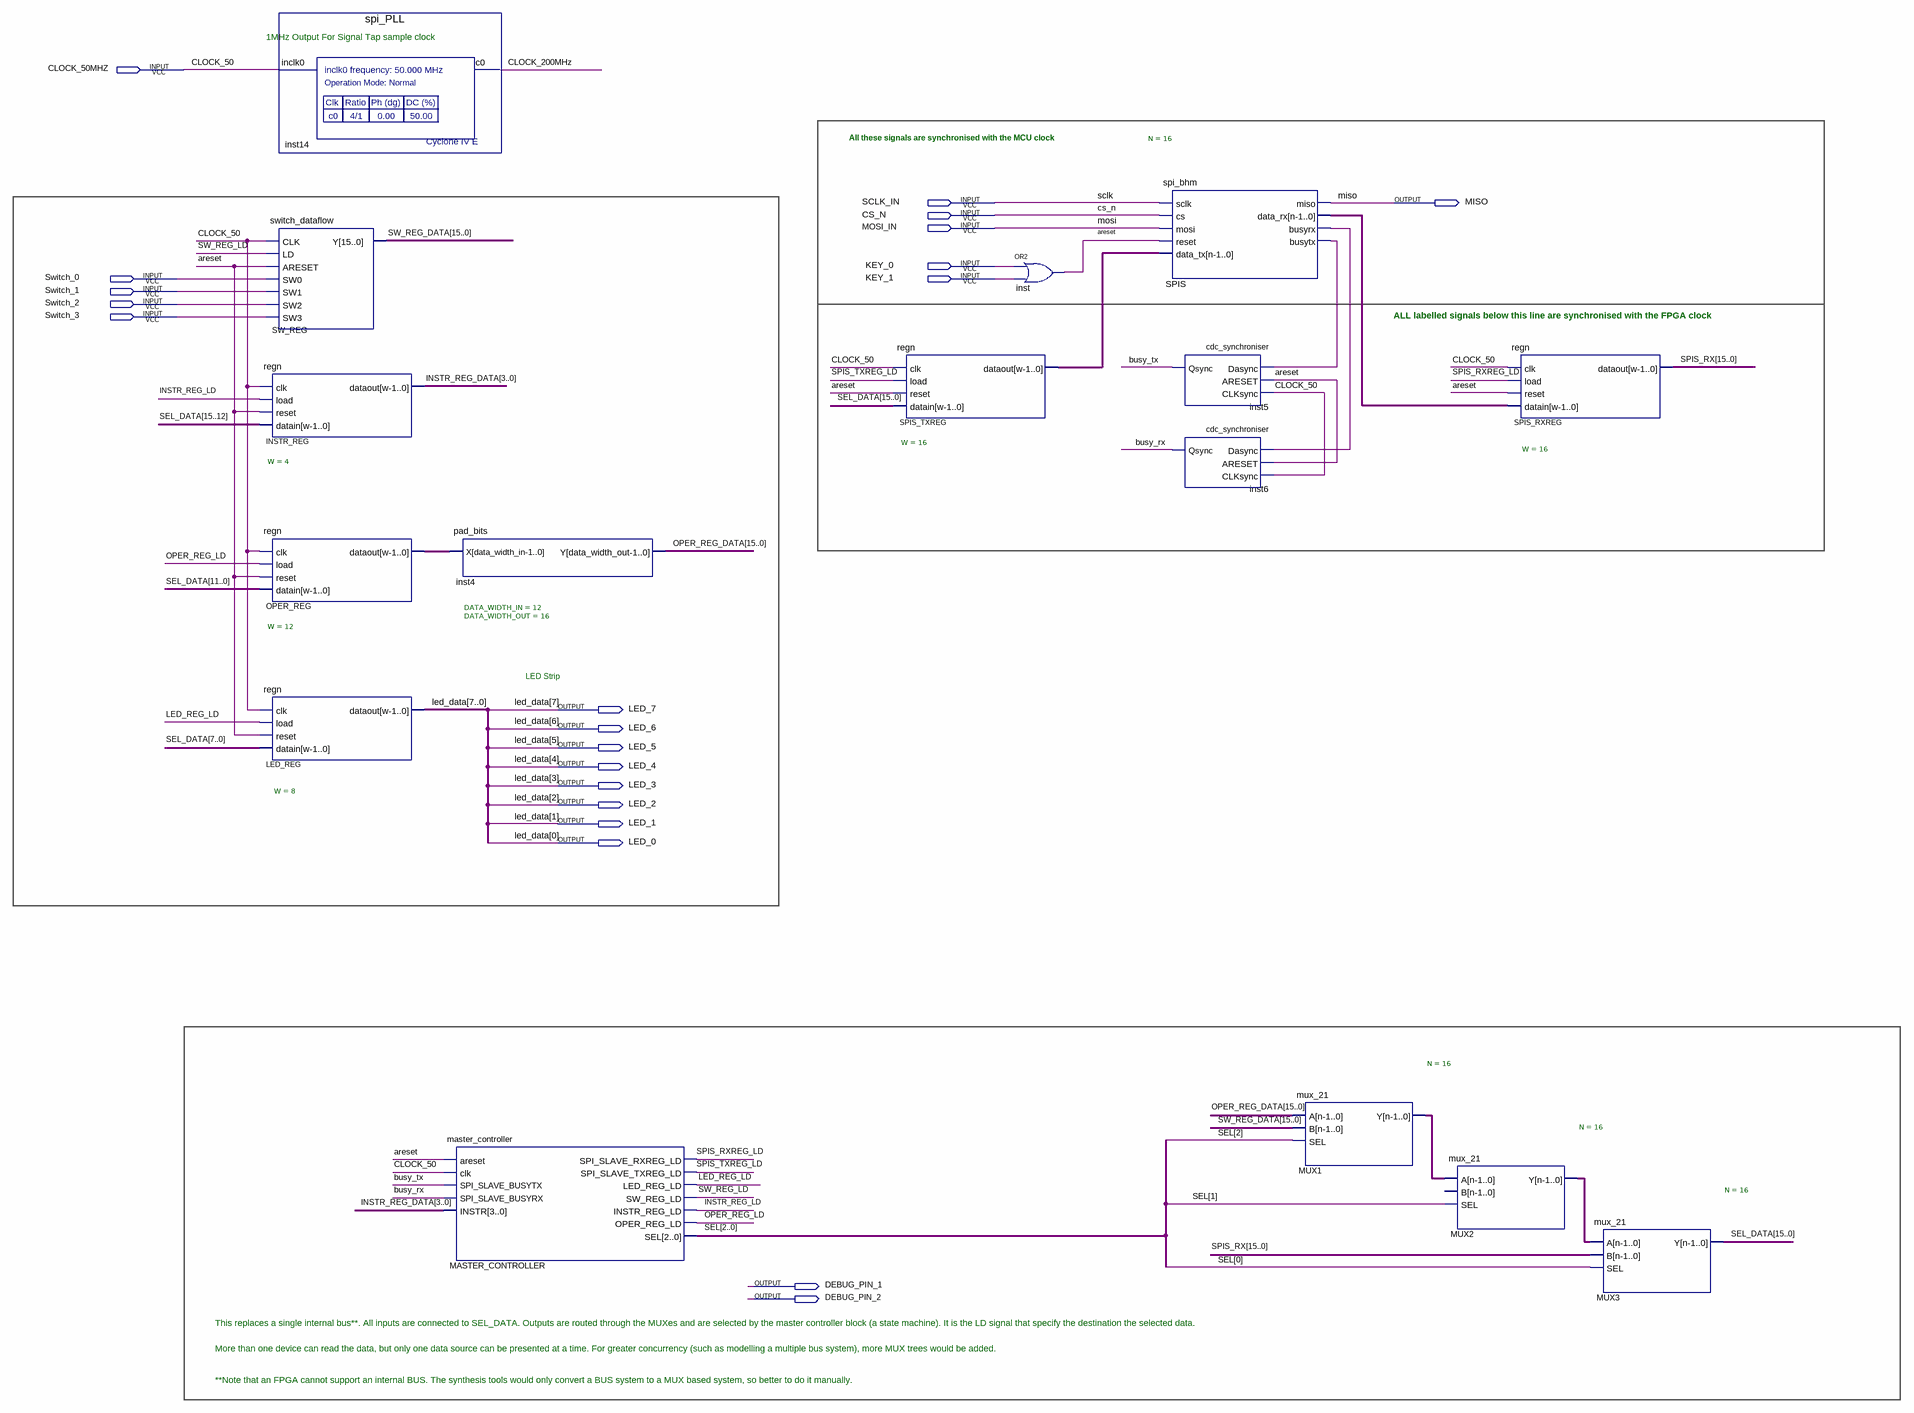
[diagram p0: schematic sheet]
// Quartus schematic spi_test.bdf as structural Verilog: 16 symbols, 21 pins
module spi_test (
  input  CLOCK_50MHZ,
  input  SCLK_IN,
  input  CS_N,
  input  MOSI_IN,
  input  KEY_0,
  input  Switch_0,
  input  KEY_1,
  input  Switch_1,
  input  Switch_2,
  input  Switch_3,
  output MISO,
  output LED_7,
  output LED_6,
  output LED_5,
  output LED_4,
  output LED_3,
  output LED_2,
  output LED_1,
  output LED_0,
  output DEBUG_PIN_1,
  output DEBUG_PIN_2
);

  wire areset, busy_rx, busy_tx, CLOCK_200MHz, INSTR_REG_LD, LED_REG_LD, OPER_REG_LD, SPIS_busyrx,
       SPIS_busytx, SPIS_RXREG_LD, SPIS_TXREG_LD, SW_REG_LD;
  wire [2:0] SEL;
  wire [3:0] INSTR_REG_DATA;
  wire [11:0] OPER_REG_dataout;
  wire [15:0] MUX1_y, MUX2_y, OPER_REG_DATA, SEL_DATA, SPIS_data_rx, SPIS_RX, SPIS_TXREG_dataout, SW_REG_DATA;

  switch_dataflow SW_REG (
    .CLK(CLOCK_50MHZ), .LD(SW_REG_LD), .ARESET(areset), .SW0(Switch_0), .SW1(Switch_1), .SW2(Switch_2),
    .SW3(Switch_3), .Y(SW_REG_DATA));
  regn #(.W(4)) INSTR_REG (
    .clk(CLOCK_50MHZ), .load(INSTR_REG_LD), .reset(areset), .datain(SEL_DATA[15:12]), .dataout(INSTR_REG_DATA));
  regn #(.W(12)) OPER_REG (
    .clk(CLOCK_50MHZ), .load(OPER_REG_LD), .reset(areset), .datain(SEL_DATA[11:0]), .dataout(OPER_REG_dataout));
  regn #(.W(8)) LED_REG (
    .clk(CLOCK_50MHZ), .load(LED_REG_LD), .reset(areset), .datain(SEL_DATA[7:0]),
    .dataout({LED_7, LED_6, LED_5, LED_4, LED_3, LED_2, LED_1, LED_0}));
  spi_PLL inst14 (.inclk0(CLOCK_50MHZ), .c0(CLOCK_200MHz));
  pad_bits #(.DATA_WIDTH_IN(12), .DATA_WIDTH_OUT(16)) inst4 (.X(OPER_REG_dataout), .Y(OPER_REG_DATA));
  master_controller MASTER_CONTROLLER (
    .areset(areset), .clk(CLOCK_50MHZ), .SPI_SLAVE_BUSYTX(busy_tx), .SPI_SLAVE_BUSYRX(busy_rx),
    .INSTR(INSTR_REG_DATA), .SPI_SLAVE_RXREG_LD(SPIS_RXREG_LD), .SPI_SLAVE_TXREG_LD(SPIS_TXREG_LD),
    .LED_REG_LD(LED_REG_LD), .SW_REG_LD(SW_REG_LD), .INSTR_REG_LD(INSTR_REG_LD), .OPER_REG_LD(OPER_REG_LD),
    .SEL(SEL));
  regn #(.W(16)) SPIS_TXREG (
    .clk(CLOCK_50MHZ), .load(SPIS_TXREG_LD), .reset(areset), .datain(SEL_DATA), .dataout(SPIS_TXREG_dataout));
  or inst (areset, KEY_0, KEY_1);
  spi_bhm #(.N(16)) SPIS (
    .sclk(SCLK_IN), .cs(CS_N), .mosi(MOSI_IN), .reset(areset), .data_tx(SPIS_TXREG_dataout), .miso(MISO),
    .data_rx(SPIS_data_rx), .busyrx(SPIS_busyrx), .busytx(SPIS_busytx));
  cdc_synchroniser inst5 (.Dasync(SPIS_busytx), .ARESET(areset), .CLKsync(CLOCK_50MHZ), .Qsync(busy_tx));
  cdc_synchroniser inst6 (.Dasync(SPIS_busyrx), .ARESET(areset), .CLKsync(CLOCK_50MHZ), .Qsync(busy_rx));
  mux_21 #(.N(16)) MUX1 (.A(OPER_REG_DATA), .B(SW_REG_DATA), .SEL(SEL[2]), .Y(MUX1_y));
  mux_21 #(.N(16)) MUX2 (.A(MUX1_y), .SEL(SEL[1]), .Y(MUX2_y));  // open: B
  regn #(.W(16)) SPIS_RXREG (
    .clk(CLOCK_50MHZ), .load(SPIS_RXREG_LD), .reset(areset), .datain(SPIS_data_rx), .dataout(SPIS_RX));
  mux_21 #(.N(16)) MUX3 (.A(MUX2_y), .B(SPIS_RX), .SEL(SEL[0]), .Y(SEL_DATA));

  // Other names for the same wires on the sheet: CLOCK_50 = CLOCK_50MHZ;
  //   led_data[7:0] = {LED_7, LED_6, LED_5, LED_4, LED_3, LED_2, LED_1, LED_0}; mosi = MOSI_IN; sclk = SCLK_IN

  // Notes on the sheet:
  //   1MHz Output For Signal Tap sample clock
  //   All these signals are synchronised with the MCU clock
  //   ALL labelled signals below this line are synchronised with the FPGA clock
  //   LED Strip
  //   This replaces a single internal bus**. All inputs are connected to SEL_DATA. Outputs are routed through the MUXes and are selected by the master controller block (a state machine). It is the LD signal that specify the destination the selected data. 
  //   More than one device can read the data, but only one data source can be presented at a time. For greater concurrency (such as modelling a multiple bus system), more MUX trees would be added.
  //   **Note that an FPGA cannot support an internal BUS. The synthesis tools would only convert a BUS system to a MUX based system, so better to do it manually.
endmodule
